# Altium schematic sheet IzmirHs IoT PCB Project Schematic.SchDoc
size A4
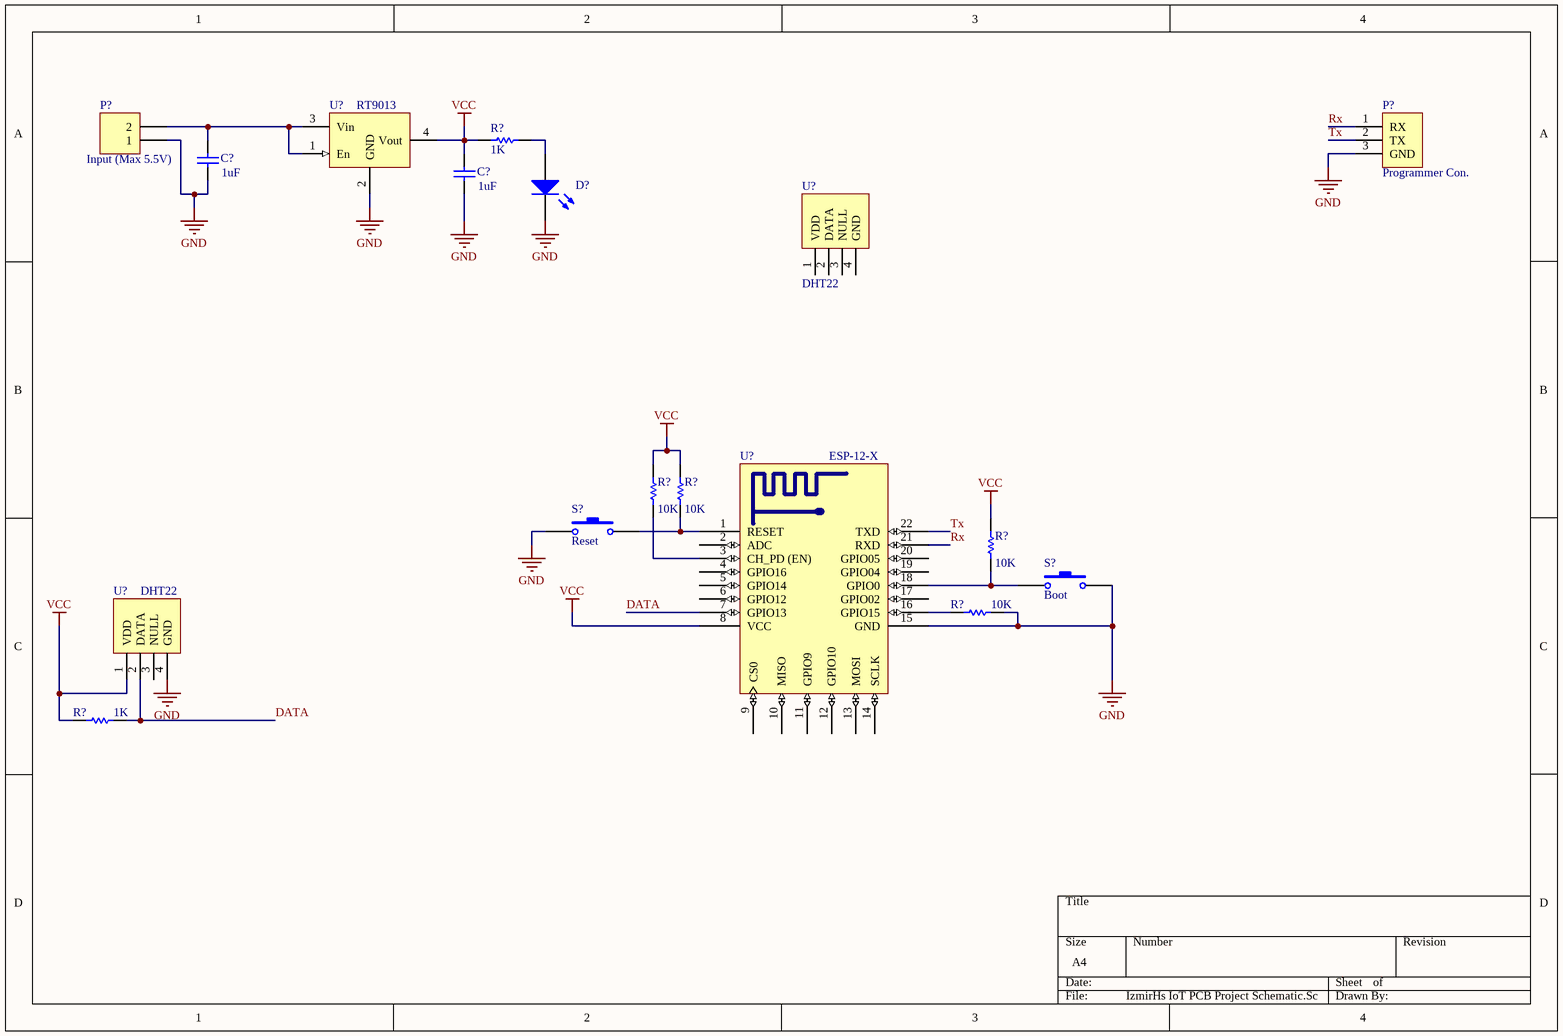
[diagram p0: IzmirHs IoT PCB Project Schematic.SchDoc]

## Parts
(Parts that share a designator on the sheet are numbered #1, #2 ... from top to bottom, then left to right.)
C?#1  value 1uF  [C1206]  (hidden comment: Cap Semi)
C?#2  value 1uF  [C1206]  (hidden comment: Cap Semi)
D?  LED3  [3.5X2.8X1.9]  (value not drawn)
P?#1  Programmer Con.  [HDR1X3]
P?#2  Input (Max 5.5V)  [HDR1X2]
R?#1  value 1K  [AXIAL-0.3]  (hidden comment: Res1)
R?#2  value 10K  [AXIAL-0.3]  (hidden comment: Res1)
R?#3  value 10K  [AXIAL-0.3]  (hidden comment: Res1)
R?#4  value 10K  [AXIAL-0.3]  (hidden comment: Res1)
R?#5  value 10K  [AXIAL-0.3]  (hidden comment: Res1)
R?#6  value 1K  [AXIAL-0.3]  (hidden comment: Res1)
S?#1  Reset  [SPST-2]
S?#2  Boot  [SPST-2]
U?#1  RT9013  [SOT23-5]
U?#2  DHT22
U?#3  ESP-12-X  [ESP_1x]
U?#4  DHT22

## Nets
GND: C?#1.1 C?#2.1 D?.2(K) P?#1.3(GND) P?#2.1 R?#5.2 S?#1.1 S?#2.2 U?#1.2(GND) U?#3.15(GND) U?#4.4(GND)
VCC: C?#2.2 R?#1.2 R?#2.2 R?#3.2 R?#4.2 R?#6.1 U?#1.4(Vout) U?#3.8(VCC) U?#4.1(VDD)
DATA: R?#6.2 U?#3.7(GPIO13) U?#4.2(DATA)
Rx: P?#1.1(RX) U?#3.21(RXD)
Tx: P?#1.2(TX) U?#3.22(TXD)
NetC?#1_2: C?#1.2 P?#2.2 U?#1.1(En) U?#1.3(Vin)
NetD?_1: D?.1(A) R?#1.1
NetR?#2_1: R?#2.1 U?#3.3(CH_PD_(EN))
NetR?#3_1: R?#3.1 S?#1.2 U?#3.1(RESET)
NetR?#4_1: R?#4.1 S?#2.1 U?#3.18(GPIO0)
NetR?#5_1: R?#5.1 U?#3.16(GPIO15)

Not connected (* = marked no-connect by the designer): U?#2 1(VDD) 2(DATA) 3(NULL) 4(GND); U?#3 2(ADC) 4(GPIO16) 5(GPIO14) 6(GPIO12) 9(CS0) 10(MISO) 11(GPIO9) 12(GPIO10) 13(MOSI) 14(SCLK) 17(GPIO02) 19(GPIO04) 20(GPIO05); U?#4 3(NULL)

## Library data of the parts
C?#1 C?#2 = Cap Semi: Capacitor (Semiconductor SIM Model); Published: 8-Jun-2000; LatestRevisionDate: 29-May-2009; LatestRevisionNote: IPC-7351 Footprint Added.; PackageReference: C1206; Publisher: Altium Limited; PackageDescription: Chip Capacitor
D? = LED3: Typical BLUE SiC LED; Published: 8-Jun-2000; LatestRevisionDate: 17-Dec-2003; LatestRevisionNote: PCB Footprint replaced.; DatasheetVersion: 16-Apr-2002; PackageVersion: 16-Apr-2002; PackageReference: 3.5X2.8X1.9; Publisher: Altium Limited; PackageDescription: SM LED; 2 C-Bend Leads; Body 3.5 x 2.8 x 1.9 mm, inc leads (LxWxH typ)
P?#1 = Header 3: Header, 3-Pin; LatestRevisionDate: 17-Jul-2002; LatestRevisionNote: Re-released for DXP Platform.; Publisher: Altium Limited
P?#2 = Header 2: Header, 2-Pin; LatestRevisionDate: 17-Jul-2002; LatestRevisionNote: Re-released for DXP Platform.; Publisher: Altium Limited
R?#1-R?#6 = Res1: Resistor; Published: 8-Jun-2000; LatestRevisionDate: 17-Jul-2002; LatestRevisionNote: Re-released for DXP Platform.; PackageReference: AXIAL-0.3; Publisher: Altium Limited; PackageDescription: Axial Device, Thru-Hole; 2 Leads; 0.3 in Pin Spacing
S?#1 S?#2 = SW-PB: Switch; Published: 24-Mar-1999; LatestRevisionDate: 17-Jul-2002; LatestRevisionNote: Re-released for DXP Platform.; PackageReference: SPST-2; Publisher: Altium Limited; PackageDescription: Switch; 2 Leads
U?#1 = RT9013C: Liner LDO
U?#2 U?#4 = DHTxx: Digital-output relative humidity & temperature sensor/module
U?#3 = ESP-1X: IoT ESP Series